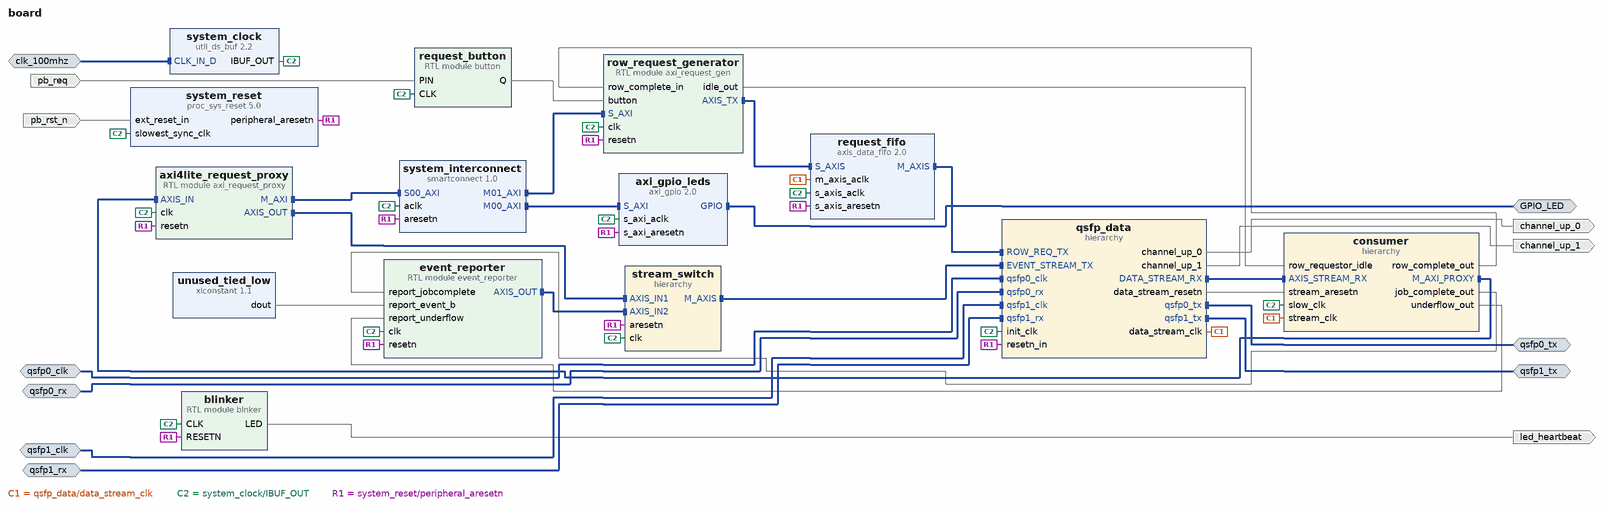
[diagram p0: block diagram of the top level]
# Vivado block design board, xczu19eg-ffvc1760-2-i, Vivado 2021.1
create_bd_design board

create_bd_intf_port -mode Slave -vlnv xilinx.com:interface:diff_clock_rtl:1.0 clk_100mhz
create_bd_intf_port -mode Slave -vlnv xilinx.com:interface:diff_clock_rtl:1.0 qsfp1_clk
set_property -dict {CONFIG.FREQ_HZ 322265625} [get_bd_intf_ports qsfp1_clk]
create_bd_intf_port -mode Slave -vlnv xilinx.com:display_aurora:GT_Serial_Transceiver_Pins_RX_rtl:1.0 qsfp1_rx
create_bd_intf_port -mode Master -vlnv xilinx.com:display_aurora:GT_Serial_Transceiver_Pins_TX_rtl:1.0 qsfp1_tx
create_bd_intf_port -mode Slave -vlnv xilinx.com:interface:diff_clock_rtl:1.0 qsfp0_clk
set_property -dict {CONFIG.FREQ_HZ 322265625} [get_bd_intf_ports qsfp0_clk]
create_bd_intf_port -mode Master -vlnv xilinx.com:display_aurora:GT_Serial_Transceiver_Pins_TX_rtl:1.0 qsfp0_tx
create_bd_intf_port -mode Slave -vlnv xilinx.com:display_aurora:GT_Serial_Transceiver_Pins_RX_rtl:1.0 qsfp0_rx
create_bd_intf_port -mode Master -vlnv xilinx.com:interface:gpio_rtl:1.0 GPIO_LED
create_bd_port -dir O led_heartbeat
create_bd_port -dir I -type rst pb_rst_n
create_bd_port -dir I pb_req
create_bd_port -dir O channel_up_1
create_bd_port -dir O channel_up_0

create_bd_cell -type ip -vlnv xilinx.com:ip:util_ds_buf:2.2 system_clock
create_bd_cell -type ip -vlnv xilinx.com:ip:proc_sys_reset:5.0 system_reset
set_property -dict {CONFIG.C_AUX_RESET_HIGH 0} [get_bd_cells system_reset]
create_bd_cell -type module -reference binker blinker
create_bd_cell -type hier qsfp_data
create_bd_cell -type module -reference button request_button
set_property -dict {CONFIG.ACTIVE_STATE 0 CONFIG.CLOCKS_PER_USEC 400} [get_bd_cells request_button]
create_bd_cell -type ip -vlnv xilinx.com:ip:axis_data_fifo:2.0 request_fifo
set_property -dict {CONFIG.FIFO_DEPTH 256 CONFIG.IS_ACLK_ASYNC 1} [get_bd_cells request_fifo]
create_bd_cell -type hier consumer
create_bd_cell -type ip -vlnv xilinx.com:ip:axi_gpio:2.0 axi_gpio_leds
set_property -dict {CONFIG.C_ALL_OUTPUTS 1 CONFIG.C_GPIO_WIDTH 4} [get_bd_cells axi_gpio_leds]
create_bd_cell -type ip -vlnv xilinx.com:ip:smartconnect:1.0 system_interconnect
set_property -dict {CONFIG.NUM_MI 2 CONFIG.NUM_SI 1} [get_bd_cells system_interconnect]
create_bd_cell -type module -reference axi_request_proxy axi4lite_request_proxy
create_bd_cell -type hier stream_switch
create_bd_cell -type ip -vlnv xilinx.com:ip:xlconstant:1.1 unused_tied_low
set_property -dict {CONFIG.CONST_VAL 0} [get_bd_cells unused_tied_low]
create_bd_cell -type module -reference axi_request_gen row_request_generator
create_bd_cell -type module -reference event_reporter event_reporter

# ---- hierarchy /qsfp_data ----
current_bd_instance /qsfp_data
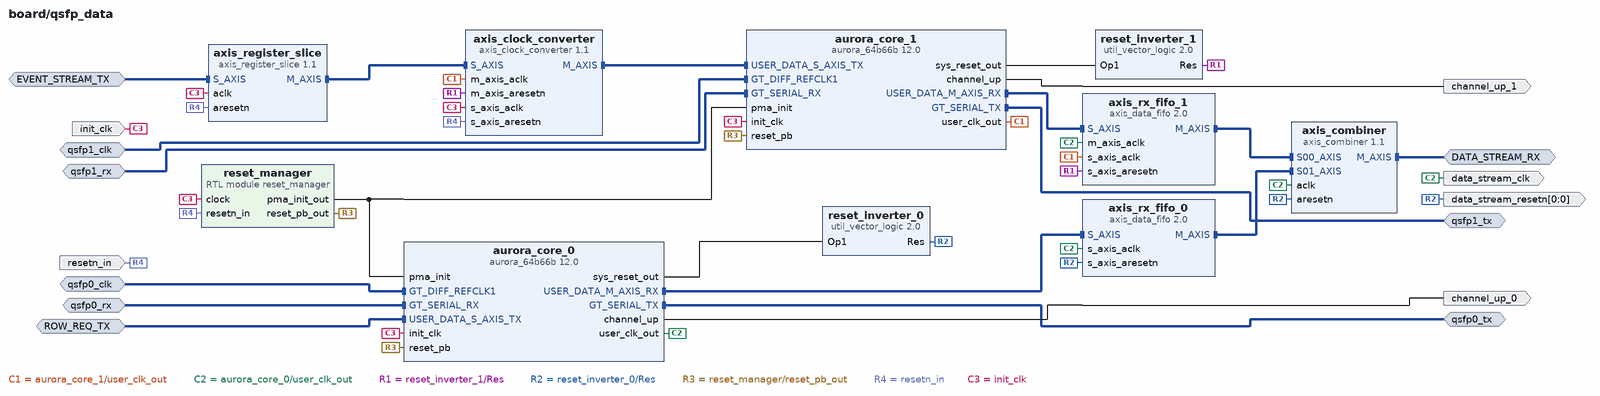
[diagram p1: block diagram inside /qsfp_data]
create_bd_intf_pin -mode Slave -vlnv xilinx.com:interface:axis_rtl:1.0 ROW_REQ_TX
create_bd_intf_pin -mode Slave -vlnv xilinx.com:interface:diff_clock_rtl:1.0 qsfp0_clk
create_bd_intf_pin -mode Master -vlnv xilinx.com:display_aurora:GT_Serial_Transceiver_Pins_TX_rtl:1.0 qsfp0_tx
create_bd_intf_pin -mode Slave -vlnv xilinx.com:display_aurora:GT_Serial_Transceiver_Pins_RX_rtl:1.0 qsfp0_rx
create_bd_intf_pin -mode Slave -vlnv xilinx.com:interface:diff_clock_rtl:1.0 qsfp1_clk
create_bd_intf_pin -mode Master -vlnv xilinx.com:display_aurora:GT_Serial_Transceiver_Pins_TX_rtl:1.0 qsfp1_tx
create_bd_intf_pin -mode Slave -vlnv xilinx.com:display_aurora:GT_Serial_Transceiver_Pins_RX_rtl:1.0 qsfp1_rx
create_bd_intf_pin -mode Master -vlnv xilinx.com:interface:axis_rtl:1.0 DATA_STREAM_RX
create_bd_intf_pin -mode Slave -vlnv xilinx.com:interface:axis_rtl:1.0 EVENT_STREAM_TX
create_bd_pin -dir O channel_up_0
create_bd_pin -dir I -type clk init_clk
create_bd_pin -dir O -type clk data_stream_clk
create_bd_pin -dir O -from 0 -to 0 data_stream_resetn
create_bd_pin -dir O channel_up_1
create_bd_pin -dir I resetn_in

create_bd_cell -type ip -vlnv xilinx.com:ip:aurora_64b66b:12.0 aurora_core_0
set_property -dict [list \
  CONFIG.CHANNEL_ENABLE {X0Y12 X0Y13 X0Y14 X0Y15} \
  CONFIG.C_AURORA_LANES 4 \
  CONFIG.C_GT_CLOCK_1 GTYQ0 \
  CONFIG.C_GT_TYPE GTY \
  CONFIG.C_LINE_RATE 25.78125 \
  CONFIG.C_REFCLK_FREQUENCY 322.265625 \
  CONFIG.C_REFCLK_SOURCE MGTREFCLK0_of_Quad_X0Y3 \
  CONFIG.C_START_LANE X0Y12 \
  CONFIG.C_START_QUAD Quad_X0Y3 \
  CONFIG.C_UCOLUMN_USED left \
  CONFIG.SupportLevel 1 \
  CONFIG.drp_mode Disabled \
  CONFIG.interface_mode Streaming \
] [get_bd_cells aurora_core_0]
create_bd_cell -type ip -vlnv xilinx.com:ip:util_vector_logic:2.0 reset_inverter_0
set_property -dict {CONFIG.C_OPERATION not CONFIG.C_SIZE 1} [get_bd_cells reset_inverter_0]
create_bd_cell -type ip -vlnv xilinx.com:ip:aurora_64b66b:12.0 aurora_core_1
set_property -dict [list \
  CONFIG.CHANNEL_ENABLE {X0Y16 X0Y17 X0Y18 X0Y19} \
  CONFIG.C_AURORA_LANES 4 \
  CONFIG.C_GT_CLOCK_1 GTYQ0 \
  CONFIG.C_GT_TYPE GTY \
  CONFIG.C_LINE_RATE 25.78125 \
  CONFIG.C_REFCLK_FREQUENCY 322.265625 \
  CONFIG.C_REFCLK_SOURCE MGTREFCLK0_of_Quad_X0Y4 \
  CONFIG.C_START_LANE X0Y16 \
  CONFIG.C_START_QUAD Quad_X0Y4 \
  CONFIG.C_UCOLUMN_USED left \
  CONFIG.SupportLevel 1 \
  CONFIG.TransceiverControl false \
  CONFIG.drp_mode Disabled \
  CONFIG.interface_mode Streaming \
] [get_bd_cells aurora_core_1]
create_bd_cell -type ip -vlnv xilinx.com:ip:axis_data_fifo:2.0 axis_rx_fifo_0
create_bd_cell -type ip -vlnv xilinx.com:ip:axis_data_fifo:2.0 axis_rx_fifo_1
set_property -dict {CONFIG.IS_ACLK_ASYNC 1} [get_bd_cells axis_rx_fifo_1]
create_bd_cell -type ip -vlnv xilinx.com:ip:axis_combiner:1.1 axis_combiner
create_bd_cell -type ip -vlnv xilinx.com:ip:util_vector_logic:2.0 reset_inverter_1
set_property -dict {CONFIG.C_OPERATION not CONFIG.C_SIZE 1} [get_bd_cells reset_inverter_1]
create_bd_cell -type ip -vlnv xilinx.com:ip:axis_clock_converter:1.1 axis_clock_converter
create_bd_cell -type module -reference reset_manager reset_manager
create_bd_cell -type ip -vlnv xilinx.com:ip:axis_register_slice:1.1 axis_register_slice

# ---- hierarchy /consumer ----
current_bd_instance /consumer
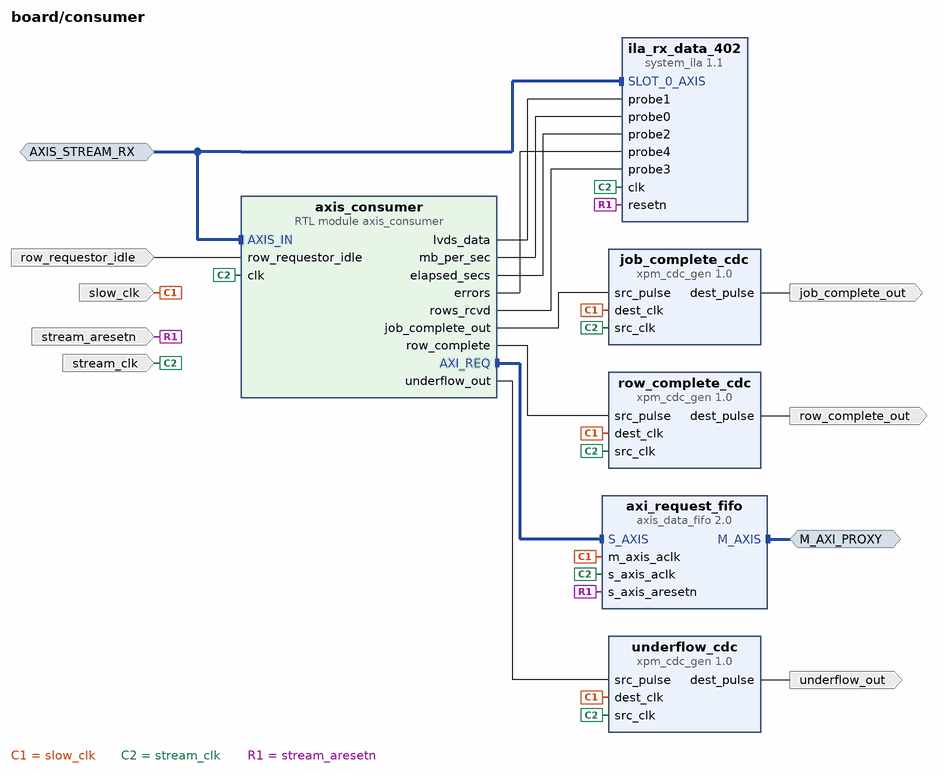
[diagram p2: block diagram inside /consumer]
create_bd_intf_pin -mode Slave -vlnv xilinx.com:interface:axis_rtl:1.0 AXIS_STREAM_RX
create_bd_intf_pin -mode Master -vlnv xilinx.com:interface:axis_rtl:1.0 M_AXI_PROXY
create_bd_pin -dir I -type clk stream_clk
create_bd_pin -dir I -type clk slow_clk
create_bd_pin -dir O row_complete_out
create_bd_pin -dir I -type rst stream_aresetn
create_bd_pin -dir I row_requestor_idle
create_bd_pin -dir O underflow_out
create_bd_pin -dir O job_complete_out

create_bd_cell -type ip -vlnv xilinx.com:ip:xpm_cdc_gen:1.0 row_complete_cdc
set_property -dict [list \
  CONFIG.CDC_TYPE xpm_cdc_pulse \
  CONFIG.RST_USED false \
  CONFIG.SIM_ASSERT_CHK false \
] [get_bd_cells row_complete_cdc]
create_bd_cell -type ip -vlnv xilinx.com:ip:axis_data_fifo:2.0 axi_request_fifo
set_property -dict {CONFIG.FIFO_DEPTH 16 CONFIG.IS_ACLK_ASYNC 1} [get_bd_cells axi_request_fifo]
create_bd_cell -type ip -vlnv xilinx.com:ip:system_ila:1.1 ila_rx_data_402
set_property -dict [list \
  CONFIG.C_MON_TYPE MIX \
  CONFIG.C_NUM_MONITOR_SLOTS 1 \
  CONFIG.C_NUM_OF_PROBES 5 \
  CONFIG.C_PROBE0_TYPE 0 \
  CONFIG.C_PROBE1_TYPE 0 \
  CONFIG.C_PROBE2_TYPE 0 \
  CONFIG.C_PROBE3_TYPE 0 \
  CONFIG.C_PROBE4_TYPE 0 \
  CONFIG.C_PROBE5_TYPE 0 \
  CONFIG.C_SLOT_0_APC_EN 0 \
  CONFIG.C_SLOT_0_AXI_DATA_SEL 1 \
  CONFIG.C_SLOT_0_AXI_TRIG_SEL 1 \
  CONFIG.C_SLOT_0_INTF_TYPE xilinx.com:interface:axis_rtl:1.0 \
  CONFIG.C_SLOT_0_TYPE 0 \
  CONFIG.C_SLOT_1_APC_EN 0 \
  CONFIG.C_SLOT_1_AXI_DATA_SEL 1 \
  CONFIG.C_SLOT_1_AXI_TRIG_SEL 1 \
  CONFIG.C_SLOT_1_INTF_TYPE xilinx.com:interface:axis_rtl:1.0 \
  CONFIG.C_SLOT_1_TYPE 0 \
  CONFIG.C_SLOT_2_APC_EN 0 \
  CONFIG.C_SLOT_2_AXI_DATA_SEL 1 \
  CONFIG.C_SLOT_2_AXI_TRIG_SEL 1 \
  CONFIG.C_SLOT_2_INTF_TYPE xilinx.com:interface:axis_rtl:1.0 \
] [get_bd_cells ila_rx_data_402]
create_bd_cell -type ip -vlnv xilinx.com:ip:xpm_cdc_gen:1.0 underflow_cdc
set_property -dict {CONFIG.CDC_TYPE xpm_cdc_pulse CONFIG.RST_USED false CONFIG.SIM_ASSERT_CHK false} [get_bd_cells underflow_cdc]
create_bd_cell -type module -reference axis_consumer axis_consumer
create_bd_cell -type ip -vlnv xilinx.com:ip:xpm_cdc_gen:1.0 job_complete_cdc
set_property -dict [list \
  CONFIG.CDC_TYPE xpm_cdc_pulse \
  CONFIG.RST_USED false \
  CONFIG.SIM_ASSERT_CHK false \
] [get_bd_cells job_complete_cdc]

# ---- hierarchy /stream_switch ----
current_bd_instance /stream_switch
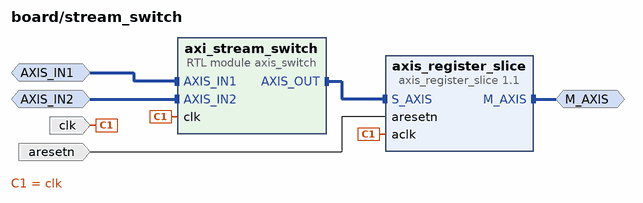
[diagram p3: block diagram inside /stream_switch]
create_bd_intf_pin -mode Slave -vlnv xilinx.com:interface:axis_rtl:1.0 AXIS_IN1
create_bd_intf_pin -mode Slave -vlnv xilinx.com:interface:axis_rtl:1.0 AXIS_IN2
create_bd_intf_pin -mode Master -vlnv xilinx.com:interface:axis_rtl:1.0 M_AXIS
create_bd_pin -dir I -type clk clk
create_bd_pin -dir I -type rst aresetn

create_bd_cell -type module -reference axis_switch axi_stream_switch
create_bd_cell -type ip -vlnv xilinx.com:ip:axis_register_slice:1.1 axis_register_slice

# ---- connections ----

current_bd_instance /qsfp_data
connect_bd_intf_net [get_bd_intf_pins qsfp1_clk] [get_bd_intf_pins aurora_core_1/GT_DIFF_REFCLK1]
connect_bd_intf_net [get_bd_intf_pins qsfp1_tx] [get_bd_intf_pins aurora_core_1/GT_SERIAL_TX]
connect_bd_intf_net [get_bd_intf_pins qsfp1_rx] [get_bd_intf_pins aurora_core_1/GT_SERIAL_RX]
connect_bd_intf_net [get_bd_intf_pins EVENT_STREAM_TX] [get_bd_intf_pins axis_register_slice/S_AXIS]
connect_bd_intf_net -intf_net GT_DIFF_REFCLK1_0_1 [get_bd_intf_pins qsfp0_clk] [get_bd_intf_pins aurora_core_0/GT_DIFF_REFCLK1]
connect_bd_intf_net -intf_net GT_SERIAL_RX_0_1 [get_bd_intf_pins qsfp0_rx] [get_bd_intf_pins aurora_core_0/GT_SERIAL_RX]
connect_bd_intf_net [get_bd_intf_pins aurora_core_0/USER_DATA_M_AXIS_RX] [get_bd_intf_pins axis_rx_fifo_0/S_AXIS]
connect_bd_intf_net [get_bd_intf_pins aurora_core_1/USER_DATA_M_AXIS_RX] [get_bd_intf_pins axis_rx_fifo_1/S_AXIS]
connect_bd_intf_net -intf_net aurora_core_GT_SERIAL_TX [get_bd_intf_pins qsfp0_tx] [get_bd_intf_pins aurora_core_0/GT_SERIAL_TX]
connect_bd_intf_net [get_bd_intf_pins aurora_core_1/USER_DATA_S_AXIS_TX] [get_bd_intf_pins axis_clock_converter/M_AXIS]
connect_bd_intf_net -intf_net axis_combiner_M_AXIS [get_bd_intf_pins DATA_STREAM_RX] [get_bd_intf_pins axis_combiner/M_AXIS]
connect_bd_intf_net -intf_net axis_register_slice_0_M_AXIS [get_bd_intf_pins axis_register_slice/M_AXIS] [get_bd_intf_pins axis_clock_converter/S_AXIS]
connect_bd_intf_net [get_bd_intf_pins axis_rx_fifo_0/M_AXIS] [get_bd_intf_pins axis_combiner/S01_AXIS]
connect_bd_intf_net [get_bd_intf_pins axis_rx_fifo_1/M_AXIS] [get_bd_intf_pins axis_combiner/S00_AXIS]
connect_bd_intf_net -intf_net bandwidth_test_0_OUT_AXIS [get_bd_intf_pins ROW_REQ_TX] [get_bd_intf_pins aurora_core_0/USER_DATA_S_AXIS_TX]
connect_bd_net [get_bd_pins aurora_core_1/channel_up] [get_bd_pins channel_up_1]
connect_bd_net [get_bd_pins aurora_core_1/sys_reset_out] [get_bd_pins reset_inverter_1/Op1]
connect_bd_net [get_bd_pins aurora_core_1/user_clk_out] [get_bd_pins axis_rx_fifo_1/s_axis_aclk] [get_bd_pins axis_clock_converter/m_axis_aclk]
connect_bd_net -net aurora_core_channel_up1 [get_bd_pins aurora_core_0/channel_up] [get_bd_pins channel_up_0]
connect_bd_net -net aurora_core_sys_reset_out [get_bd_pins aurora_core_0/sys_reset_out] [get_bd_pins reset_inverter_0/Op1]
connect_bd_net -net aurora_core_user_clk_out [get_bd_pins aurora_core_0/user_clk_out] \
  [get_bd_pins data_stream_clk] [get_bd_pins axis_rx_fifo_0/s_axis_aclk] [get_bd_pins axis_rx_fifo_1/m_axis_aclk] \
  [get_bd_pins axis_combiner/aclk]
connect_bd_net [get_bd_pins reset_inverter_1/Res] [get_bd_pins axis_rx_fifo_1/s_axis_aresetn] [get_bd_pins axis_clock_converter/m_axis_aresetn]
connect_bd_net -net reset_inverter_Res [get_bd_pins reset_inverter_0/Res] \
  [get_bd_pins data_stream_resetn] [get_bd_pins axis_rx_fifo_0/s_axis_aresetn] [get_bd_pins axis_combiner/aresetn]
connect_bd_net -net reset_manager_0_pma_init_out [get_bd_pins reset_manager/pma_init_out] \
  [get_bd_pins aurora_core_0/pma_init] [get_bd_pins aurora_core_1/pma_init]
connect_bd_net -net reset_manager_0_reset_pb_out [get_bd_pins reset_manager/reset_pb_out] \
  [get_bd_pins aurora_core_0/reset_pb] [get_bd_pins aurora_core_1/reset_pb]
connect_bd_net [get_bd_pins resetn_in] \
  [get_bd_pins reset_manager/resetn_in] [get_bd_pins axis_clock_converter/s_axis_aresetn] \
  [get_bd_pins axis_register_slice/aresetn]
connect_bd_net -net system_clock_IBUF_OUT [get_bd_pins init_clk] \
  [get_bd_pins aurora_core_0/init_clk] [get_bd_pins aurora_core_1/init_clk] [get_bd_pins axis_clock_converter/s_axis_aclk] \
  [get_bd_pins reset_manager/clock] [get_bd_pins axis_register_slice/aclk]
set_property HDL_ATTRIBUTE.DEBUG true [get_bd_intf_nets axis_combiner_M_AXIS]

current_bd_instance /consumer
connect_bd_intf_net -intf_net AXIS1_1 [get_bd_intf_pins AXIS_STREAM_RX] [get_bd_intf_pins axis_consumer/AXIS_IN]
connect_bd_intf_net [get_bd_intf_pins AXIS_STREAM_RX] [get_bd_intf_pins ila_rx_data_402/SLOT_0_AXIS]
connect_bd_intf_net [get_bd_intf_pins M_AXI_PROXY] [get_bd_intf_pins axi_request_fifo/M_AXIS]
connect_bd_intf_net [get_bd_intf_pins axi_request_fifo/S_AXIS] [get_bd_intf_pins axis_consumer/AXI_REQ]
connect_bd_net [get_bd_pins axis_consumer/job_complete_out] [get_bd_pins job_complete_cdc/src_pulse]
connect_bd_net -net axis_consumer_lvds_data [get_bd_pins axis_consumer/lvds_data] [get_bd_pins ila_rx_data_402/probe1]
connect_bd_net -net axis_consumer_mb_per_sec [get_bd_pins axis_consumer/mb_per_sec] [get_bd_pins ila_rx_data_402/probe0]
connect_bd_net [get_bd_pins axis_consumer/underflow_out] [get_bd_pins underflow_cdc/src_pulse]
connect_bd_net -net dest_clk_1 [get_bd_pins slow_clk] \
  [get_bd_pins row_complete_cdc/dest_clk] [get_bd_pins axi_request_fifo/m_axis_aclk] [get_bd_pins underflow_cdc/dest_clk] \
  [get_bd_pins job_complete_cdc/dest_clk]
connect_bd_net -net elapsed_secs [get_bd_pins axis_consumer/elapsed_secs] [get_bd_pins ila_rx_data_402/probe2]
connect_bd_net -net errors [get_bd_pins axis_consumer/errors] [get_bd_pins ila_rx_data_402/probe4]
connect_bd_net [get_bd_pins job_complete_cdc/dest_pulse] [get_bd_pins job_complete_out]
connect_bd_net -net qsfp_data_user_clk_out [get_bd_pins stream_clk] \
  [get_bd_pins row_complete_cdc/src_clk] [get_bd_pins axi_request_fifo/s_axis_aclk] [get_bd_pins ila_rx_data_402/clk] \
  [get_bd_pins underflow_cdc/src_clk] [get_bd_pins axis_consumer/clk] [get_bd_pins job_complete_cdc/src_clk]
connect_bd_net -net row_complete [get_bd_pins axis_consumer/row_complete] [get_bd_pins row_complete_cdc/src_pulse]
connect_bd_net [get_bd_pins row_complete_cdc/dest_pulse] [get_bd_pins row_complete_out]
connect_bd_net [get_bd_pins row_requestor_idle] [get_bd_pins axis_consumer/row_requestor_idle]
connect_bd_net -net rows_rcvd [get_bd_pins axis_consumer/rows_rcvd] [get_bd_pins ila_rx_data_402/probe3]
connect_bd_net -net s_axis_aresetn_1 [get_bd_pins stream_aresetn] [get_bd_pins axi_request_fifo/s_axis_aresetn] [get_bd_pins ila_rx_data_402/resetn]
connect_bd_net [get_bd_pins underflow_cdc/dest_pulse] [get_bd_pins underflow_out]
set_property HDL_ATTRIBUTE.DEBUG true [get_bd_intf_nets AXIS1_1]
set_property HDL_ATTRIBUTE.MARK_DEBUG true [get_bd_intf_nets AXIS1_1]
set_property HDL_ATTRIBUTE.DEBUG true [get_bd_nets axis_consumer_lvds_data]
set_property HDL_ATTRIBUTE.MARK_DEBUG true [get_bd_nets axis_consumer_lvds_data]
set_property HDL_ATTRIBUTE.DEBUG true [get_bd_nets axis_consumer_mb_per_sec]
set_property HDL_ATTRIBUTE.MARK_DEBUG true [get_bd_nets axis_consumer_mb_per_sec]
set_property HDL_ATTRIBUTE.DEBUG true [get_bd_nets elapsed_secs]
set_property HDL_ATTRIBUTE.MARK_DEBUG true [get_bd_nets elapsed_secs]
set_property HDL_ATTRIBUTE.DEBUG true [get_bd_nets errors]
set_property HDL_ATTRIBUTE.MARK_DEBUG true [get_bd_nets errors]
set_property HDL_ATTRIBUTE.DEBUG true [get_bd_nets rows_rcvd]
set_property HDL_ATTRIBUTE.MARK_DEBUG true [get_bd_nets rows_rcvd]

current_bd_instance /stream_switch
connect_bd_intf_net [get_bd_intf_pins M_AXIS] [get_bd_intf_pins axis_register_slice/M_AXIS]
connect_bd_intf_net -intf_net axi_request_proxy_AXIS_OUT [get_bd_intf_pins AXIS_IN1] [get_bd_intf_pins axi_stream_switch/AXIS_IN1]
connect_bd_intf_net [get_bd_intf_pins axi_stream_switch/AXIS_OUT] [get_bd_intf_pins axis_register_slice/S_AXIS]
connect_bd_intf_net -intf_net event_reporter_0_AXIS_OUT [get_bd_intf_pins AXIS_IN2] [get_bd_intf_pins axi_stream_switch/AXIS_IN2]
connect_bd_net [get_bd_pins aresetn] [get_bd_pins axis_register_slice/aresetn]
connect_bd_net -net system_clock_IBUF_OUT [get_bd_pins clk] [get_bd_pins axi_stream_switch/clk] [get_bd_pins axis_register_slice/aclk]

current_bd_instance /
connect_bd_intf_net -intf_net AXIS1_1 [get_bd_intf_pins consumer/AXIS_STREAM_RX] [get_bd_intf_pins qsfp_data/DATA_STREAM_RX]
connect_bd_intf_net -intf_net CLK_IN_D_0_1 [get_bd_intf_ports clk_100mhz] [get_bd_intf_pins system_clock/CLK_IN_D]
connect_bd_intf_net [get_bd_intf_pins qsfp_data/EVENT_STREAM_TX] [get_bd_intf_pins stream_switch/M_AXIS]
connect_bd_intf_net -intf_net GT_DIFF_REFCLK1_0_1 [get_bd_intf_ports qsfp0_clk] [get_bd_intf_pins qsfp_data/qsfp0_clk]
connect_bd_intf_net -intf_net GT_SERIAL_RX_0_1 [get_bd_intf_ports qsfp0_rx] [get_bd_intf_pins qsfp_data/qsfp0_rx]
connect_bd_intf_net -intf_net aurora_core_GT_SERIAL_TX [get_bd_intf_ports qsfp0_tx] [get_bd_intf_pins qsfp_data/qsfp0_tx]
connect_bd_intf_net -intf_net axi_gpio_0_GPIO [get_bd_intf_ports GPIO_LED] [get_bd_intf_pins axi_gpio_leds/GPIO]
connect_bd_intf_net -intf_net axi_request_proxy_AXIS_OUT [get_bd_intf_pins axi4lite_request_proxy/AXIS_OUT] [get_bd_intf_pins stream_switch/AXIS_IN1]
connect_bd_intf_net -intf_net axi_request_proxy_M_AXI [get_bd_intf_pins system_interconnect/S00_AXI] [get_bd_intf_pins axi4lite_request_proxy/M_AXI]
connect_bd_intf_net -intf_net axis_data_fifo_0_M_AXIS [get_bd_intf_pins request_fifo/M_AXIS] [get_bd_intf_pins qsfp_data/ROW_REQ_TX]
connect_bd_intf_net -intf_net consumer_M_AXIS [get_bd_intf_pins axi4lite_request_proxy/AXIS_IN] [get_bd_intf_pins consumer/M_AXI_PROXY]
connect_bd_intf_net -intf_net event_reporter_0_AXIS_OUT [get_bd_intf_pins event_reporter/AXIS_OUT] [get_bd_intf_pins stream_switch/AXIS_IN2]
connect_bd_intf_net [get_bd_intf_ports qsfp1_clk] [get_bd_intf_pins qsfp_data/qsfp1_clk]
connect_bd_intf_net [get_bd_intf_ports qsfp1_rx] [get_bd_intf_pins qsfp_data/qsfp1_rx]
connect_bd_intf_net [get_bd_intf_ports qsfp1_tx] [get_bd_intf_pins qsfp_data/qsfp1_tx]
connect_bd_intf_net -intf_net request_generator_AXIS_TX [get_bd_intf_pins row_request_generator/AXIS_TX] [get_bd_intf_pins request_fifo/S_AXIS]
connect_bd_intf_net -intf_net smartconnect_0_M00_AXI [get_bd_intf_pins system_interconnect/M00_AXI] [get_bd_intf_pins axi_gpio_leds/S_AXI]
connect_bd_intf_net [get_bd_intf_pins system_interconnect/M01_AXI] [get_bd_intf_pins row_request_generator/S_AXI]
connect_bd_net -net PIN_0_1 [get_bd_ports pb_req] [get_bd_pins request_button/PIN]
connect_bd_net -net binker_0_LED [get_bd_pins blinker/LED] [get_bd_ports led_heartbeat]
connect_bd_net -net consumer_dest_pulse [get_bd_pins consumer/job_complete_out] [get_bd_pins event_reporter/report_jobcomplete]
connect_bd_net -net consumer_row_complete [get_bd_pins consumer/row_complete_out] [get_bd_pins row_request_generator/row_complete_in]
connect_bd_net [get_bd_pins consumer/underflow_out] [get_bd_pins event_reporter/report_underflow]
connect_bd_net -net ext_reset_in_0_1 [get_bd_ports pb_rst_n] [get_bd_pins system_reset/ext_reset_in]
connect_bd_net [get_bd_pins qsfp_data/channel_up_0] [get_bd_ports channel_up_0]
connect_bd_net [get_bd_pins qsfp_data/channel_up_1] [get_bd_ports channel_up_1]
connect_bd_net -net qsfp_data_sys_resetn_out [get_bd_pins qsfp_data/data_stream_resetn] [get_bd_pins consumer/stream_aresetn]
connect_bd_net -net qsfp_data_user_clk_out [get_bd_pins qsfp_data/data_stream_clk] \
  [get_bd_pins request_fifo/m_axis_aclk] [get_bd_pins consumer/stream_clk]
connect_bd_net [get_bd_pins request_button/Q] [get_bd_pins row_request_generator/button]
connect_bd_net -net request_generator_idle_out [get_bd_pins row_request_generator/idle_out] [get_bd_pins consumer/row_requestor_idle]
connect_bd_net [get_bd_pins system_clock/IBUF_OUT] \
  [get_bd_pins system_reset/slowest_sync_clk] [get_bd_pins blinker/CLK] [get_bd_pins qsfp_data/init_clk] \
  [get_bd_pins request_fifo/s_axis_aclk] [get_bd_pins request_button/CLK] [get_bd_pins consumer/slow_clk] \
  [get_bd_pins axi_gpio_leds/s_axi_aclk] [get_bd_pins system_interconnect/aclk] [get_bd_pins axi4lite_request_proxy/clk] \
  [get_bd_pins stream_switch/clk] [get_bd_pins row_request_generator/clk] [get_bd_pins event_reporter/clk]
connect_bd_net [get_bd_pins system_reset/peripheral_aresetn] \
  [get_bd_pins blinker/RESETN] [get_bd_pins request_fifo/s_axis_aresetn] [get_bd_pins axi_gpio_leds/s_axi_aresetn] \
  [get_bd_pins system_interconnect/aresetn] [get_bd_pins qsfp_data/resetn_in] [get_bd_pins axi4lite_request_proxy/resetn] \
  [get_bd_pins stream_switch/aresetn] [get_bd_pins row_request_generator/resetn] [get_bd_pins event_reporter/resetn]
connect_bd_net -net tied_low_dout [get_bd_pins unused_tied_low/dout] [get_bd_pins event_reporter/report_event_b]
set_property HDL_ATTRIBUTE.DEBUG true [get_bd_intf_nets AXIS1_1]
set_property HDL_ATTRIBUTE.MARK_DEBUG true [get_bd_intf_nets AXIS1_1]

# ---- address map ----
assign_bd_address -offset 0x00001000 -range 256 -target_address_space [get_bd_addr_spaces axi4lite_request_proxy/M_AXI] [get_bd_addr_segs axi_gpio_leds/S_AXI/Reg]
assign_bd_address -offset 0x00002000 -range 256 -target_address_space [get_bd_addr_spaces axi4lite_request_proxy/M_AXI] [get_bd_addr_segs row_request_generator/S_AXI/reg0]

validate_bd_design
save_bd_design
